# EAGLE design board2 (EAGLE 9.6.2)
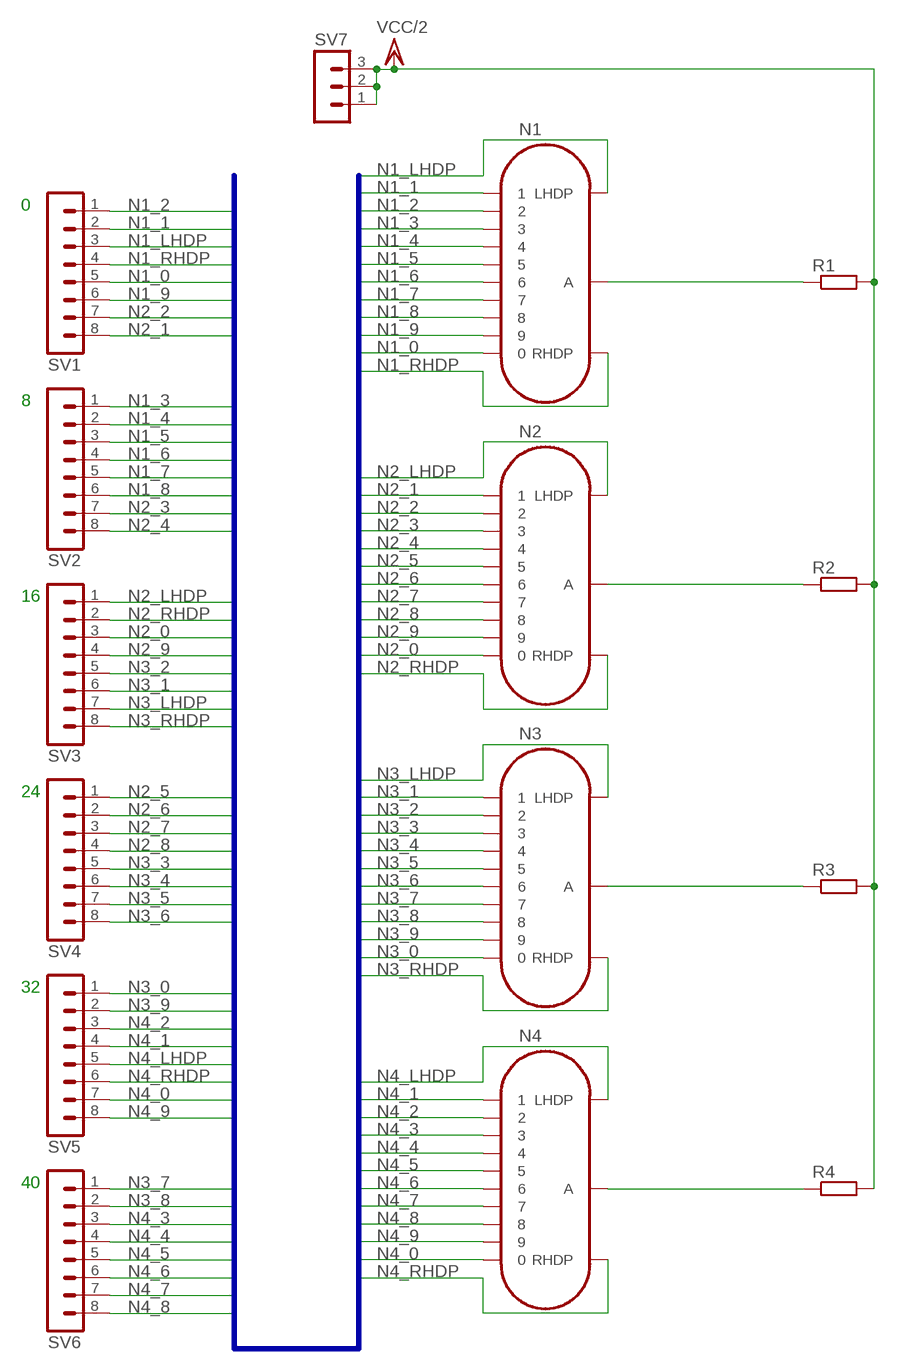
[diagram p0: schematic, sheet 1]

## Parts
N1  IN-14  [IN-14]
N2  IN-14  [IN-14]
N3  IN-14  [IN-14]
N4  IN-14  [IN-14]
R1  R-EU_0207/7  [0207/7]
R2  R-EU_0207/7  [0207/7]
R3  R-EU_0207/7  [0207/7]
R4  R-EU_0207/7  [0207/7]
SV1  MA08-1  [MA08-1]
SV2  MA08-1  [MA08-1]
SV3  MA08-1  [MA08-1]
SV4  MA08-1  [MA08-1]
SV5  MA08-1  [MA08-1]
SV6  MA08-1  [MA08-1]
SV7  MA03-1  [MA03-1]

## Nets
N1_0: N1.0 SV1.5
N1_1: N1.1 SV1.2
N1_2: N1.2 SV1.1
N1_3: N1.3 SV2.1
N1_4: N1.4 SV2.2
N1_5: N1.5 SV2.3
N1_6: N1.6 SV2.4
N1_7: N1.7 SV2.5
N1_8: N1.8 SV2.6
N1_9: N1.9 SV1.6
N1_LHDP: N1.LHDP SV1.3
N1_RHDP: N1.RHDP SV1.4
N2_0: N2.0 SV3.3
N2_1: N2.1 SV1.8
N2_2: N2.2 SV1.7
N2_3: N2.3 SV2.7
N2_4: N2.4 SV2.8
N2_5: N2.5 SV4.1
N2_6: N2.6 SV4.2
N2_7: N2.7 SV4.3
N2_8: N2.8 SV4.4
N2_9: N2.9 SV3.4
N2_LHDP: N2.LHDP SV3.1
N2_RHDP: N2.RHDP SV3.2
N3_0: N3.0 SV5.1
N3_1: N3.1 SV3.6
N3_2: N3.2 SV3.5
N3_3: N3.3 SV4.5
N3_4: N3.4 SV4.6
N3_5: N3.5 SV4.7
N3_6: N3.6 SV4.8
N3_7: N3.7 SV6.1
N3_8: N3.8 SV6.2
N3_9: N3.9 SV5.2
N3_LHDP: N3.LHDP SV3.7
N3_RHDP: N3.RHDP SV3.8
N4_0: N4.0 SV5.7
N4_1: N4.1 SV5.4
N4_2: N4.2 SV5.3
N4_3: N4.3 SV6.3
N4_4: N4.4 SV6.4
N4_5: N4.5 SV6.5
N4_6: N4.6 SV6.6
N4_7: N4.7 SV6.7
N4_8: N4.8 SV6.8
N4_9: N4.9 SV5.8
N4_LHDP: N4.LHDP SV5.5
N4_RHDP: N4.RHDP SV5.6
N$1: N1.A R1.1
N$2: N2.A R2.1
N$3: N3.A R3.1
N$4: N4.A R4.1
VCC/2: R1.2 R2.2 R3.2 R4.2 SV7.1 SV7.2 SV7.3

## Buses
N1_0,N1_6,N1_7,N1_8,N1_9,N1_LHDP,N1_RHDP,N2_0,N2_6,N2_7,N2_8,N2_LHDP,N2_RHDP,N3_1,N3_6,N3_7,N3_8,N3_9,N3_LHDP,N3_RHDP,N4_0,N4_6,N4_7,N4_8,N4_9,N4_LHDP,N4_RHDP

## Notes on the sheet
- 0
- 8
- 16
- 24
- 32
- 40

## Library data of the parts
N1-N4 = russian-nixies:IN-14: IN-14: medium numeric frontview nixie tube
R1-R4 = resistor:R-EU_: RESISTOR, European symbol
SV1-SV6 = con-lstb-mod:MA08-1: PIN HEADER; OC_FARNELL: unknown; OC_NEWARK: unknown
SV7 = con-lstb:MA03-1: PIN HEADER; OC_FARNELL: unknown; OC_NEWARK: unknown

## Board
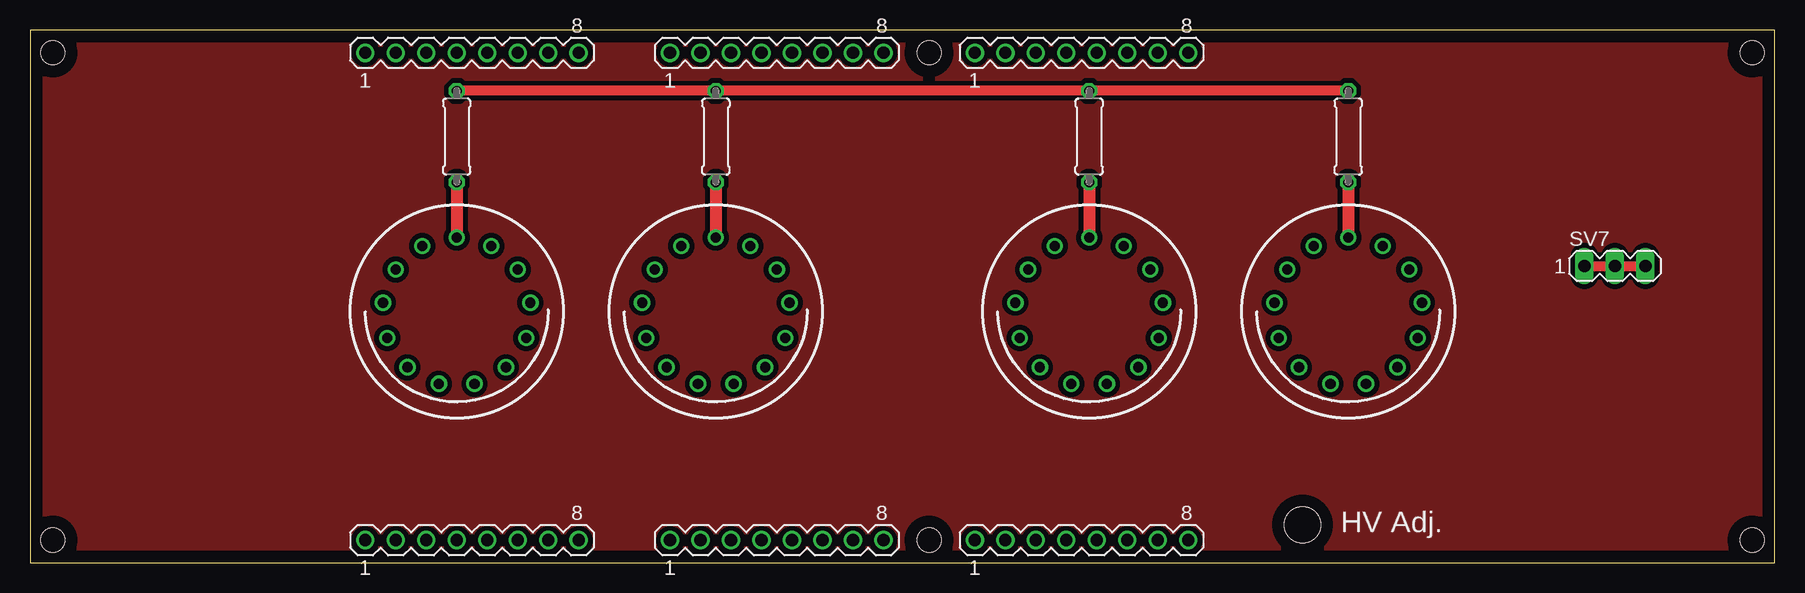
[diagram p1: board, top side]
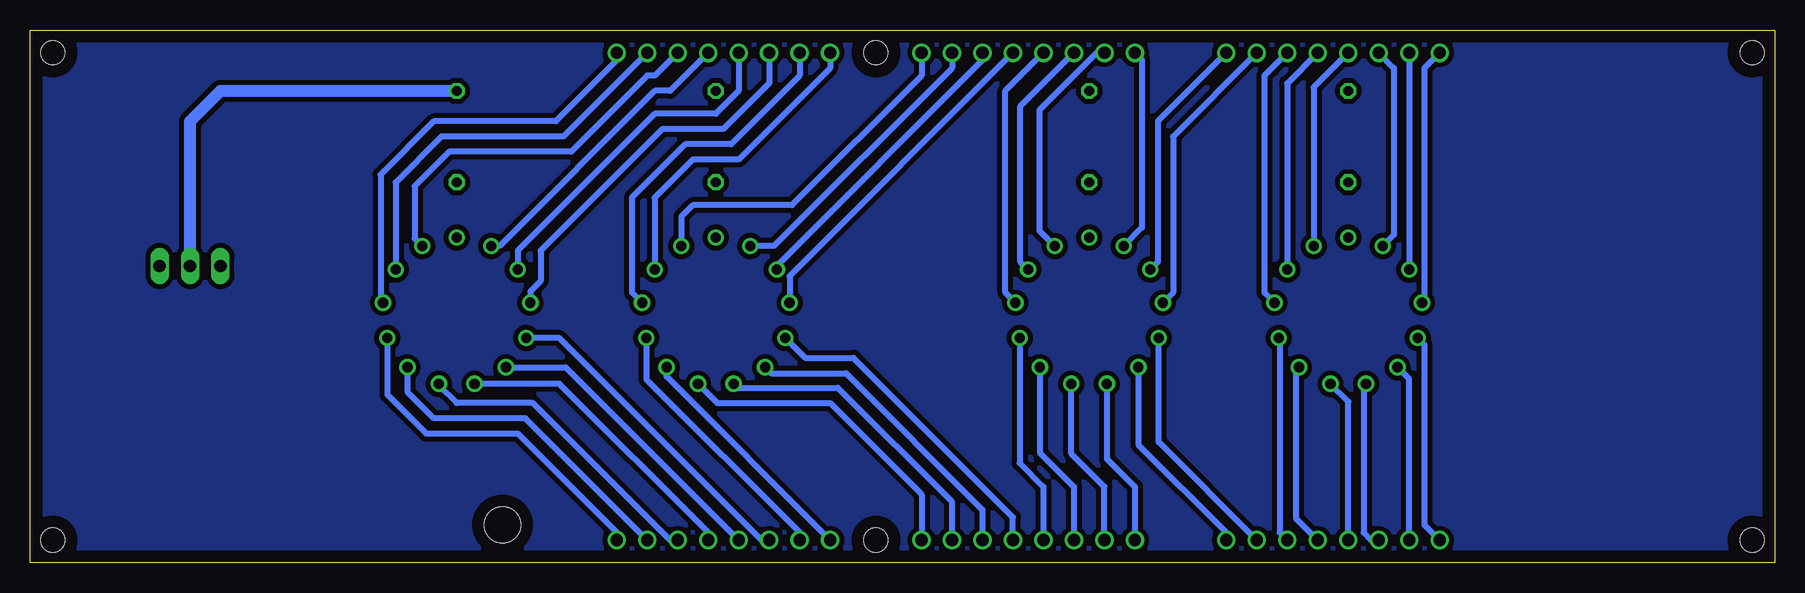
[diagram p2: board, bottom side, seen from below]

Size 145.41 x 44.45 mm. Coordinates in mm from the lower left corner, seen from the top.
Outline: 0,0 145.41,0 145.41,44.45 0,44.45 0,0
Copper layers (1*16): Top 0.035mm / dielectric 1.5mm / Bottom 0.035mm
Design rules "default": minimum track width 6mil, minimum drill 0.35mm, track to track 6mil, track to pad 6mil, pad to pad 6mil, via to via 6mil, smd to smd 6mil, copper to edge 40mil, drill to drill 6mil, minimum pad ring 10mil, minimum via ring 8mil, stop-mask expansion 4mil, vias tented up to drill 0mil, thermal gap 10mil
Holes 2 mm at 1.91,1.91 1.91,42.55 74.93,42.55 74.93,1.91 143.51,1.91 143.51,42.55
Holes 3 mm at 106.05,3.17

### Footprints (pad centres in the part's own frame; a part is rotated, then mirrored left to right if it is on the bottom)
IN-14 = drill 0.84: 0 -5.094,-3.516; 1 5.094,-3.516; 2 6.145,-0.746; 3 5.788,2.195; 4 4.105,4.633; 5 1.481,6.01; 6 -1.481,6.01; 7 -4.105,4.633; 8 -5.788,2.195; 9 -6.145,-0.746; A 0,-6.19; LHDP 2.877,-5.481; RHDP -2.877,-5.481
0207/7 = drill 0.813 octagon: 1 -3.81,0; 2 3.81,0
MA08-1 = drill 1.016: 1 -8.89,0; 2 -6.35,0; 3 -3.81,0; 4 -1.27,0; 5 1.27,0; 6 3.81,0; 7 6.35,0; 8 8.89,0
MA03-1 = drill 1.016 long: 1 -2.54,0; 2 0,0; 3 2.54,0

### Placement (x,y rotation side)
N1  35.56,20.95 180 top
N2  57.15,20.95 180 top
N3  88.27,20.95 180 top
N4  109.86,20.95 180 top
R1  35.56,35.56 90 top
R2  57.15,35.56 90 top
R3  88.27,35.56 90 top
R4  109.86,35.56 90 top
SV1  36.83,42.55 0 top
SV2  36.83,1.91 0 top
SV3  62.23,42.55 0 top
SV4  62.23,1.91 0 top
SV5  87.63,42.55 0 top
SV6  87.63,1.91 0 top
SV7  132.08,24.77 0 top

### Tracks (layer width: path | path; a pad name or v marks a point on that pad's centre or on a via)
N1_0
  Bottom 0.508: SV1.5 40.65,39.99 N1.0
N1_1
  Bottom 0.508: N1.1 30.48,24.48 SV1.2
N1_2
  Bottom 0.508: SV1.1 29.21,41.27 29.21,21.91 N1.2
N1_3
  Bottom 0.508: SV2.1 29.21,3.17 29.21,18.2 N1.3
N1_4
  Bottom 0.508: SV2.2 30.48,15.35 N1.4
N1_5
  Bottom 0.508: N1.5 34.29,14.73 34.29,2.54 33.66,1.91 SV2.3
N1_6
  Bottom 0.508: SV2.4 35.56,13.46 N1.6
N1_7
  Bottom 0.508: SV2.5 39.92,3.72 39.92,16.07 N1.7
N1_8
  Bottom 0.508: SV2.6 41.27,2.54 41.27,18.69 N1.8
N1_9
  Bottom 0.508: SV1.6 42.55,40.64 42.55,22.54 N1.9
N1_LHDP
  Bottom 0.508: N1.LHDP 31.75,27.37 31.75,41.27 SV1.3
N1_RHDP
  Bottom 0.508: SV1.4 38.44,39.67 N1.RHDP
N2_0
  Bottom 0.508: N2.0 62.88,25.11 62.88,38.09 SV3.3
N2_1
  Bottom 0.508: SV1.8 51.42,36.84 51.42,25.11 N2.1
N2_2
  Bottom 0.508: SV1.7 50.16,35.56 50.16,22.54 N2.2
N2_3
  Bottom 0.508: N2.3 51.36,10.09 SV2.7
N2_4
  Bottom 0.508: N2.4 53.05,9.87 45.72,2.54 SV2.8
N2_5
  Bottom 0.508: N2.5 55.67,8.68 53.34,6.35 SV4.1
N2_6
  Bottom 0.508: SV4.2 55.88,6.35 58.63,9.1 N2.6
N2_7
  Bottom 0.508: N2.7 61.26,9.19 58.42,6.35 SV4.3
N2_8
  Bottom 0.508: N2.8 62.94,8.33 60.96,6.35 SV4.4
N2_9
  Bottom 0.508: N2.9 64.14,22.54 64.14,39.37 SV3.4
N2_LHDP
  Bottom 0.508: SV3.1 52.75,41.95 52.75,27.96 N2.LHDP
N2_RHDP
  Bottom 0.508: SV3.2 56.52,42.55 61.3,37.76 61.3,27.71 N2.RHDP
N3_0
  Bottom 0.508: SV5.1 78.74,41.27 86.36,33.66 90.17,33.66 93.36,30.47 N3.0
N3_1
  Bottom 0.508: N3.1 83.17,24.78 66.04,41.91 SV3.6
N3_2
  Bottom 0.508: SV3.5 82.12,23.93 N3.2
N3_3
  Bottom 0.508: SV4.5 63.5,3.81 76.8,17.11 80.83,17.11 N3.3
N3_4
  Bottom 0.508: N3.4 83.65,15.81 77.41,15.81 66.04,4.45 SV4.6
N3_5
  Bottom 0.508: SV4.7 68.58,5.08 78.11,14.61 86.44,14.61 N3.5
N3_6
  Bottom 0.508: N3.6 88.14,13.34 78.74,13.34 71.12,5.71 SV4.8
N3_7
  Bottom 0.508: SV6.1 92.37,15.54 N3.7
N3_8
  Bottom 0.508: N3.8 94.05,15.31 81.28,2.54 SV6.2
N3_9
  Bottom 0.508: SV5.2 81.28,40.64 87,34.92 90.81,34.92 95.25,30.48 95.25,22.54 N3.9
N3_LHDP
  Bottom 0.508: SV3.7 68.58,41.27 83.42,26.44 N3.LHDP
N3_RHDP
  Bottom 0.508: SV3.8 71.12,40.64 81.92,29.84 90.17,29.84 91.14,28.87 N3.RHDP
N4_0
  Bottom 0.508: SV5.7 100.97,35.56 111.12,35.56 114.95,31.74 N4.0
N4_1
  Bottom 0.508: SV5.4 86.36,39.37 88.27,37.47 93.34,37.47 104.76,26.05 N4.1
N4_2
  Bottom 0.508: SV5.3 83.82,40.01 87.63,36.2 92.71,36.2 102.87,26.04 102.87,23.5 103.71,22.66 N4.2
N4_3
  Bottom 0.508: SV6.3 84.45,1.91 101.31,18.76 N4.3
N4_4
  Bottom 0.508: SV6.4 100.78,16.32 N4.4
N4_5
  Bottom 0.508: SV6.5 88.9,2.54 101.31,14.95 N4.5
N4_6
  Bottom 0.508: SV6.6 92.08,1.91 103.5,13.34 109.86,13.34 111.34,14.82 N4.6
N4_7
  Bottom 0.508: SV6.7 104.14,12.06 111.76,12.06 113.96,14.27 N4.7
N4_8
  Bottom 0.508: N4.8 115.64,14.04 112.39,10.79 104.78,10.79 96.52,2.54 SV6.8
N4_9
  Bottom 0.508: SV5.8 96.52,41.91 101.6,36.83 111.76,36.83 116.2,32.38 116.2,21.91 N4.9
N4_LHDP
  Bottom 0.508: SV5.5 92.08,39.37 93.34,39.37 106.28,26.44 N4.LHDP
N4_RHDP
  Bottom 0.508: SV5.6 93.34,40.64 93.98,40.64 100.33,34.29 110.49,34.29 113.37,31.41 113.37,27.07 N4.RHDP
N$1
  Top 1.016: R1.1 N1.A
N$2
  Top 1.016: R2.1 N2.A
N$3
  Top 1.016: R3.1 N3.A
N$4
  Top 1.016: R4.1 N4.A
N$5
  pour Bottom (isolate 0.406): 0,44.45 0,0 145.41,0 145.41,44.45
N$6
  pour Top (isolate 0.406): 0,0 0,44.45 145.41,44.45 145.41,0
VCC/2
  Top 0.813: R1.2 R2.2 R3.2 R4.2 | SV7.1 SV7.2 SV7.3
  Bottom 1.016: SV7.2 132.08,36.83 129.54,39.37 R4.2

### Text on the board
tNames: HV Adj.